# EAGLE design PS11_7000 (EAGLE 4.16)
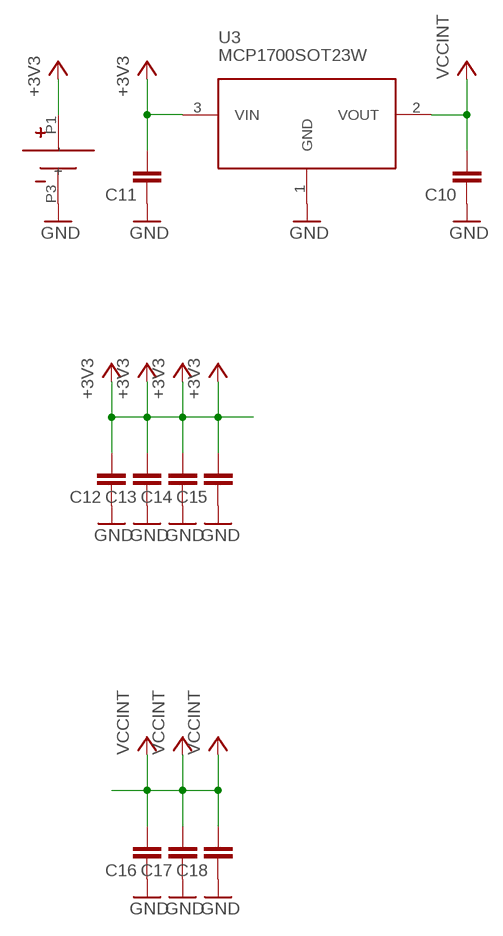
[diagram p0: schematic, sheet 1, part 1 of 2]
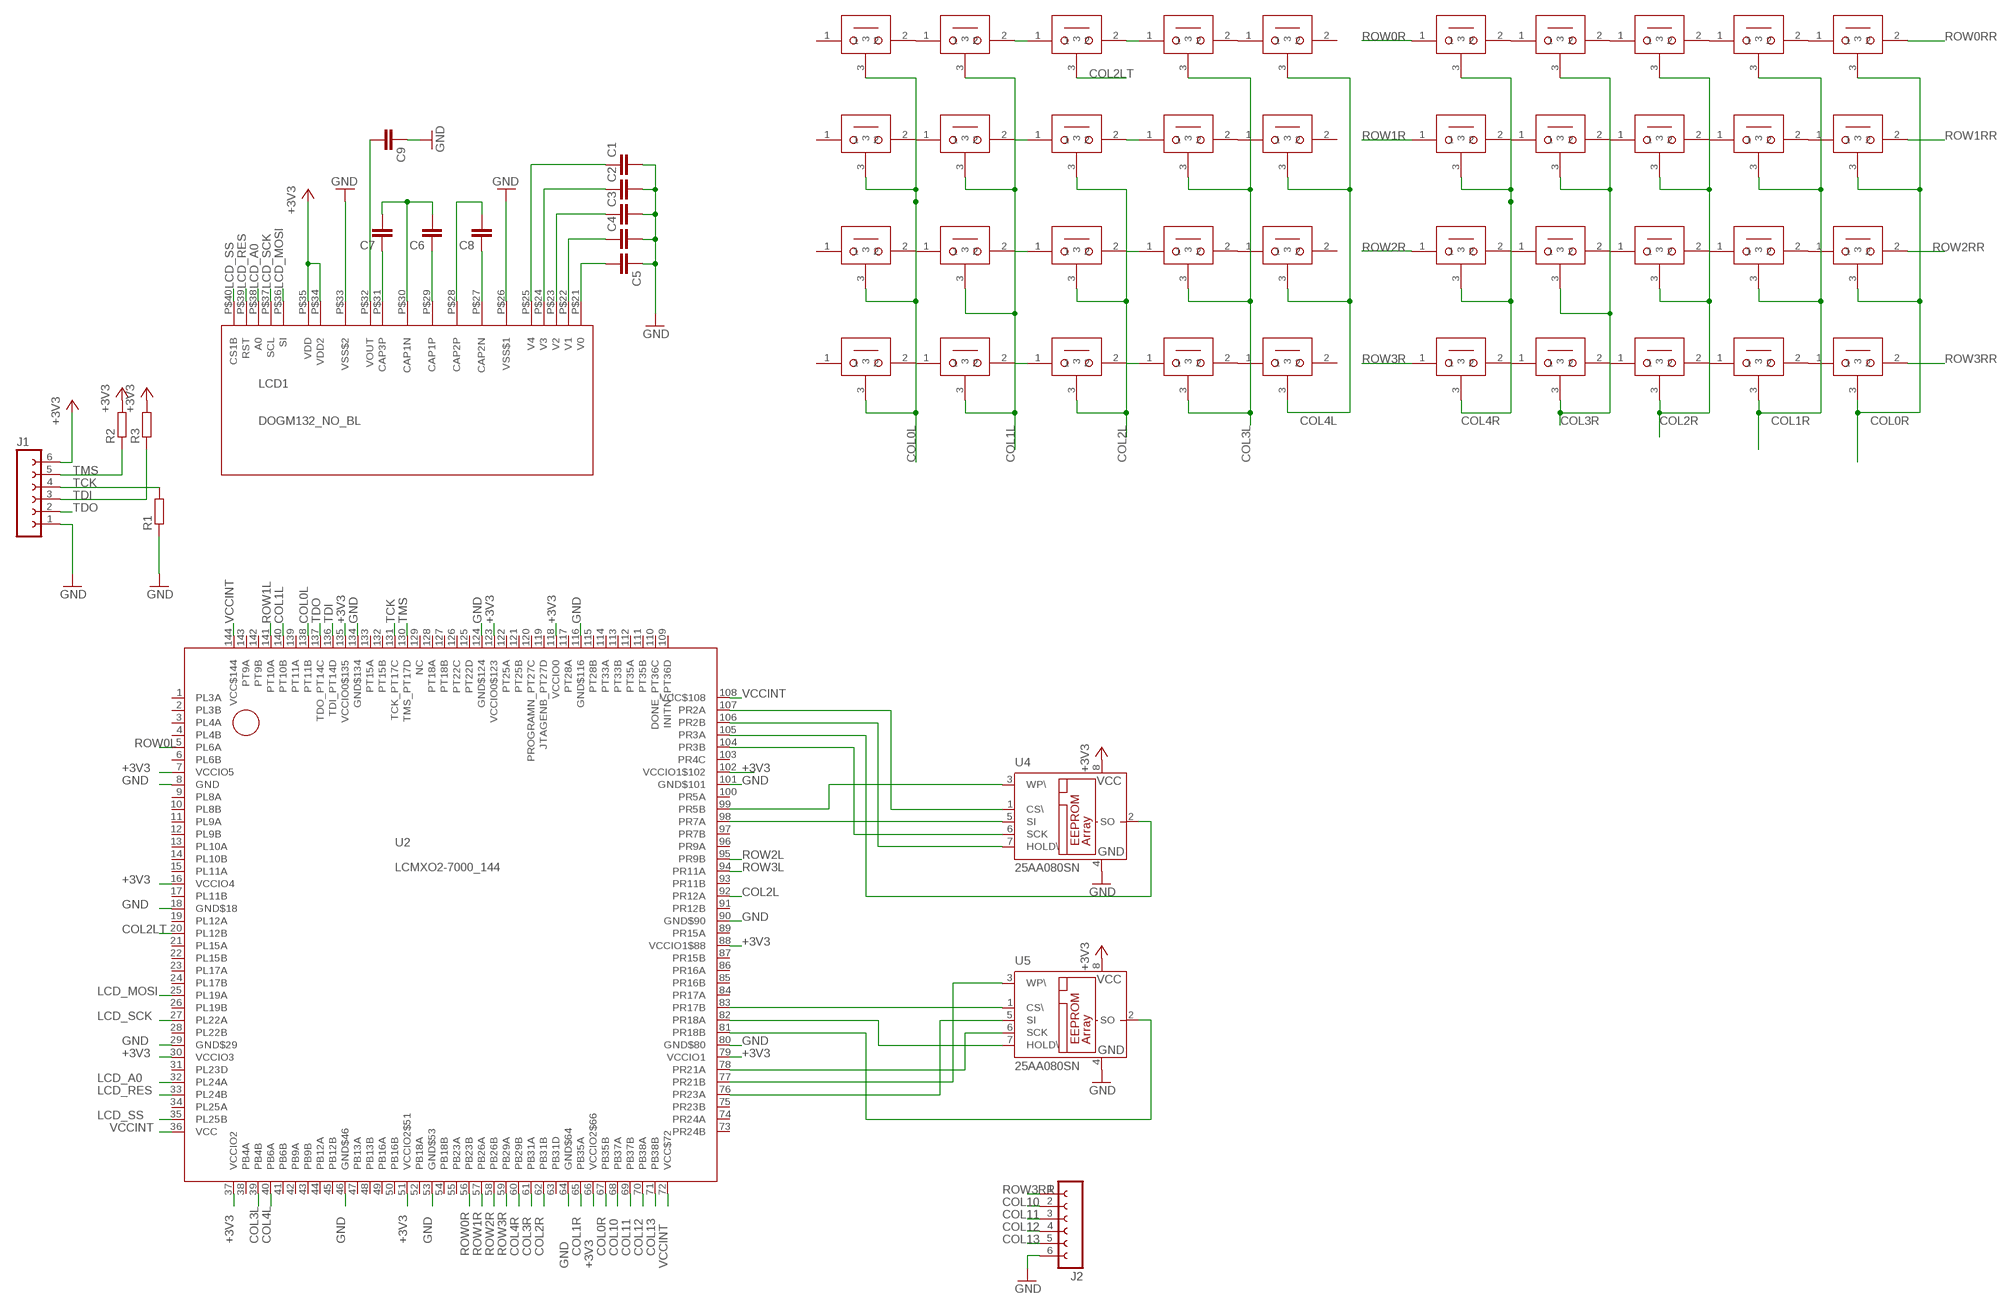
[diagram p1: schematic, sheet 1, part 2 of 2]

## Parts
C1  C-EUC1206K  [C1206K]
C2  C-EUC1206K  [C1206K]
C3  C-EUC1206K  [C1206K]
C4  C-EUC1206K  [C1206K]
C5  C-EUC1206K  [C1206K]
C6  C-EUC1206K  [C1206K]
C7  C-EUC1206K  [C1206K]
C8  C-EUC1206K  [C1206K]
C9  C-EUC1206K  [C1206K]
C10  C-EUC1206K  [C1206K]
C11  C-EUC1206K  [C1206K]
C12  C-EUC1206K  [C1206K]
C13  C-EUC1206K  [C1206K]
C14  C-EUC1206K  [C1206K]
C15  C-EUC1206K  [C1206K]
C16  C-EUC1206K  [C1206K]
C17  C-EUC1206K  [C1206K]
C18  C-EUC1206K  [C1206K]
J1  FE06-1S  [FE06-1S]
J2  FE06-1S  [FE06-1S]
LCD1  DOGM132_NO_BL  [DOGM132_NO_BL]
R1  R-EU_R1206W  [R1206W]
R2  R-EU_R1206W  [R1206W]
R3  R-EU_R1206W  [R1206W]
S1  DOME_9MM  [DOME_9MM]
S2  DOME_9MM  [DOME_9MM]
S3  DOME_9MM  [DOME_9MM]
S4  DOME_9MM  [DOME_9MM]
S5  DOME_9MM  [DOME_9MM]
S6  DOME_9MM  [DOME_9MM]
S7  DOME_9MM  [DOME_9MM]
S8  DOME_9MM  [DOME_9MM]
S9  DOME_9MM  [DOME_9MM]
S10  DOME_9MM  [DOME_9MM]
S11  DOME_9MM  [DOME_9MM]
S12  DOME_9MM  [DOME_9MM]
S13  DOME_9MM  [DOME_9MM]
S14  DOME_9MM  [DOME_9MM]
S15  DOME_9MM  [DOME_9MM]
S16  DOME_9MM  [DOME_9MM]
S17  DOME_9MM  [DOME_9MM]
S18  DOME_9MM  [DOME_9MM]
S19  DOME_9MM  [DOME_9MM]
S20  DOME_9MM  [DOME_9MM]
S21  DOME_9MM  [DOME_9MM]
S22  DOME_9MM  [DOME_9MM]
S23  DOME_9MM  [DOME_9MM]
S24  DOME_9MM  [DOME_9MM]
S25  DOME_9MM  [DOME_9MM]
S26  DOME_9MM  [DOME_9MM]
S27  DOME_9MM  [DOME_9MM]
S28  DOME_9MM  [DOME_9MM]
S29  DOME_9MM  [DOME_9MM]
S30  DOME_9MM  [DOME_9MM]
S31  DOME_9MM  [DOME_9MM]
S32  DOME_9MM  [DOME_9MM]
S33  DOME_9MM  [DOME_9MM]
S34  DOME_9MM  [DOME_9MM]
S35  DOME_9MM  [DOME_9MM]
S36  DOME_9MM  [DOME_9MM]
S37  DOME_9MM  [DOME_9MM]
S38  DOME_9MM  [DOME_9MM]
S39  DOME_9MM  [DOME_9MM]
S40  DOME_9MM  [DOME_9MM]
U2  LCMXO2-7000_144  [TQFP144]
U3  MCP1700SOT23W  [SOT23W_INFINEON]
U4  25AA080SN  [SO-08]
U5  25AA080SN  [SO-08]
U$1  LIBATT  [LIBATT_SMD]

## Nets
+3V3: C11.2 C12.2 C13.2 C14.2 C15.2 J1.6 LCD1.P$34(VDD2) LCD1.P$35(VDD) R2.2 R3.2 U2.7(VCCIO5) U2.16(VCCIO4) U2.30(VCCIO3) U2.37(VCCIO2) U2.51(VCCIO2$51) U2.66(VCCIO2$66) U2.79(VCCIO1) U2.88(VCCIO1$88) U2.102(VCCIO1$102) U2.118(VCCIO0) U2.123(VCCIO0$123) U2.135(VCCIO0$135) U3.3(VIN) U4.8(VCC) U5.8(VCC) U$1.P1(+)
COL0L: S1.3 S6.3 S11.3 S16.3 U2.138(PT11B)
COL0R: S25.3 S30.3 S35.3 S40.3 U2.67(PB35B)
COL1L: S2.3 S7.3 S12.3 S17.3 U2.140(PT10B)
COL1R: S24.3 S29.3 S34.3 S39.3 U2.65(PB35A)
COL2L: S8.3 S13.3 S18.3 U2.92(PR12A)
COL2LT: S3.3 U2.20(PL12B)
COL2R: S23.3 S28.3 S33.3 S38.3 U2.62(PB31B)
COL3L: S4.3 S9.3 S14.3 S19.3 U2.39(PB4B)
COL3R: S22.3 S27.3 S32.3 S37.3 U2.61(PB31A)
COL4L: S5.3 S10.3 S15.3 S20.3 U2.40(PB6A)
COL4R: S21.3 S26.3 S31.3 S36.3 U2.60(PB29B)
COL10: J2.2 U2.68(PB37A)
COL11: J2.3 U2.69(PB37B)
COL12: J2.4 U2.70(PB38A)
COL13: J2.5 U2.71(PB38B)
GND: C1.2 C2.2 C3.2 C4.2 C5.1 C9.1 C10.1 C11.1 C12.1 C13.1 C14.1 C15.1 C16.1 C17.1 C18.1 J1.1 J2.6 LCD1.P$26(VSS$1) LCD1.P$33(VSS$2) R1.1 U2.8(GND) U2.18(GND$18) U2.29(GND$29) U2.46(GND$46) U2.53(GND$53) U2.64(GND$64) U2.80(GND$80) U2.90(GND$90) U2.101(GND$101) U2.116(GND$116) U2.124(GND$124) U2.134(GND$134) U3.1(GND) U4.4(GND) U5.4(GND) U$1.P3(-)
LCD_A0: LCD1.P$38(A0) U2.32(PL24A)
LCD_MOSI: LCD1.P$36(SI) U2.25(PL19A)
LCD_RES: LCD1.P$39(RST) U2.33(PL24B)
LCD_SCK: LCD1.P$37(SCL) U2.27(PL22A)
LCD_SS: LCD1.P$40(CS1B) U2.35(PL25B)
N$1: C4.1 LCD1.P$22(V1)
N$2: S1.2 S2.1
N$4: C3.1 LCD1.P$23(V2)
N$5: C2.1 LCD1.P$24(V3)
N$6: C1.1 LCD1.P$25(V4)
N$8: S4.2 S5.1
N$9: S6.2 S7.1
N$12: C5.2 LCD1.P$21(V0)
N$13: U2.107(PR2A) U4.1(CS\)
N$14: S9.2 S10.1
N$15: S11.2 S12.1
N$18: S14.2 S15.1
N$19: S16.2 S17.1
N$22: S19.2 S20.1
N$23: S21.2 S22.1
N$24: S22.2 S23.1
N$25: S23.2 S24.1
N$26: S24.2 S25.1
N$27: S26.2 S27.1
N$28: S27.2 S28.1
N$29: S28.2 S29.1
N$30: S29.2 S30.1
N$31: C6.1 LCD1.P$29(CAP1P)
N$32: S31.2 S32.1
N$33: S32.2 S33.1
N$34: S33.2 S34.1
N$35: S34.2 S35.1
N$36: U2.106(PR2B) U4.7(HOLD\)
N$37: U2.105(PR3A) U4.2(SO)
N$38: U2.104(PR3B) U4.6(SCK)
N$39: S36.2 S37.1
N$40: U2.99(PR5B) U4.3(WP\)
N$41: S37.2 S38.1
N$42: S38.2 S39.1
N$43: S39.2 S40.1
N$44: U2.98(PR7A) U4.5(SI)
N$45: C6.2 C7.2 LCD1.P$30(CAP1N)
N$46: C7.1 LCD1.P$31(CAP3P)
N$47: C9.2 LCD1.P$32(VOUT)
N$48: C8.1 LCD1.P$27(CAP2N)
N$49: C8.2 LCD1.P$28(CAP2P)
N$50: U2.83(PR17B) U5.1(CS\)
N$51: U2.82(PR18A) U5.7(HOLD\)
N$52: U2.81(PR18B) U5.2(SO)
N$53: U2.78(PR21A) U5.6(SCK)
N$54: U2.77(PR21B) U5.3(WP\)
N$55: U2.76(PR23A) U5.5(SI)
N$400: S13.2 S14.1
N$401: S18.2 S19.1
N$456: S3.2 S4.1
N$457: S8.2 S9.1
ROW0L: S2.2 S3.1 U2.5(PL6A)
ROW0R: S21.1 U2.56(PB23B)
ROW0RR: S25.2
ROW1L: S7.2 S8.1 U2.141(PT10A)
ROW1R: S26.1 U2.57(PB26A)
ROW1RR: S30.2
ROW2L: S12.2 S13.1 U2.95(PR9B)
ROW2R: S31.1 U2.58(PB26B)
ROW2RR: S35.2
ROW3L: S17.2 S18.1 U2.94(PR11A)
ROW3R: S36.1 U2.59(PB29A)
ROW3RR: J2.1 S40.2
TCK: J1.4 R1.2 U2.131(TCK_PT17C)
TDI: J1.3 R3.1 U2.136(TDI_PT14D)
TDO: J1.2 U2.137(TDO_PT14C)
TMS: J1.5 R2.1 U2.130(TMS_PT17D)
VCCINT: C10.2 C16.2 C17.2 C18.2 U2.36(VCC) U2.72(VCC$72) U2.108(VCC$108) U2.144(VCC$144) U3.2(VOUT)
Unconnected: S1.1 S5.2 S6.1 S10.2 S11.1 S15.2 S16.1 S20.2 U2.1(PL3A) U2.2(PL3B) U2.3(PL4A) U2.4(PL4B) U2.6(PL6B) U2.9(PL8A) U2.10(PL8B) U2.11(PL9A) U2.12(PL9B) U2.13(PL10A) U2.14(PL10B) U2.15(PL11A) U2.17(PL11B) U2.19(PL12A) U2.21(PL15A) U2.22(PL15B) U2.23(PL17A) U2.24(PL17B) U2.26(PL19B) U2.28(PL22B) U2.31(PL23D) U2.34(PL25A) U2.38(PB4A) U2.41(PB6B) U2.42(PB9A) U2.43(PB9B) U2.44(PB12A) U2.45(PB12B) U2.47(PB13A) U2.48(PB13B) U2.49(PB16A) U2.50(PB16B) U2.52(PB18A) U2.54(PB18B) U2.55(PB23A) U2.63(PB31D) U2.73(PR24B) U2.74(PR24A) U2.75(PR23B) U2.84(PR17A) U2.85(PR16B) U2.86(PR16A) U2.87(PR15B) U2.89(PR15A) U2.91(PR12B) U2.93(PR11B) U2.96(PR9A) U2.97(PR7B) U2.100(PR5A) U2.103(PR4C) U2.109(INITN_PT36D) U2.110(DONE_PT36C) U2.111(PT35B) U2.112(PT35A) U2.113(PT33B) U2.114(PT33A) U2.115(PT28B) U2.117(PT28A) U2.119(JTAGENB_PT27D) U2.120(PROGRAMN_PT27C) U2.121(PT25B) U2.122(PT25A) U2.125(PT22D) U2.126(PT22C) U2.127(PT18B) U2.128(PT18A) U2.129(NC) U2.132(PT15B) U2.133(PT15A) U2.139(PT11A) U2.142(PT9B) U2.143(PT9A)

## Library data of the parts
C1-C18 = rcl:C-EU: CAPACITOR, European symbol
J1 J2 = con-lsta:FE06-1: FEMALE HEADER
LCD1 = DOGM:DOGM132_NO_BL
R1-R3 = rcl:R-EU_: RESISTOR, European symbol
S1-S40 = Metaldomes:DOME_9MM
U2 = MachXO2:LCMXO2-7000_144: MachXO2-7000 TQFP144
U3 = MCP17xx:MCP1700
U4 U5 = microchip:25*: Serial EEPROM 4 K, SPI bus
U$1 = MCP17xx:LIBATT

## Board
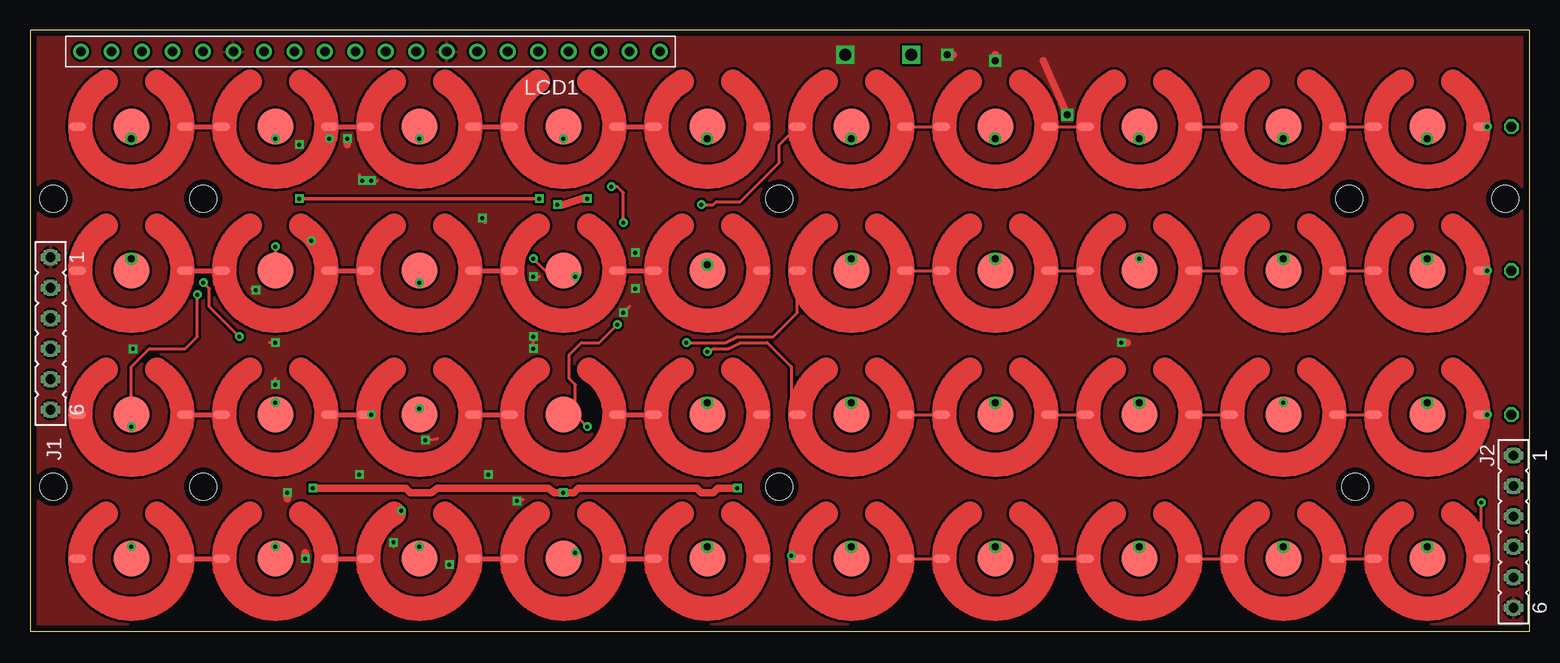
[diagram p2: board, top side]
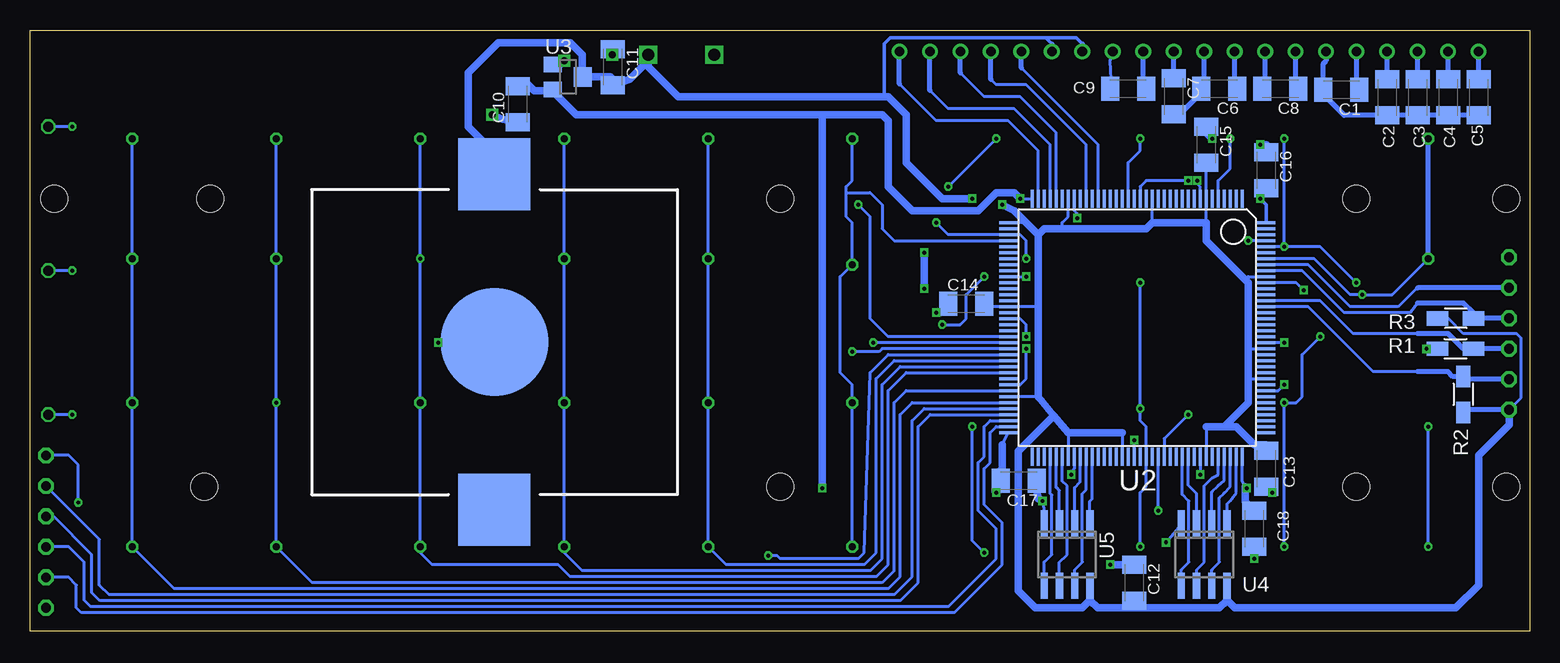
[diagram p3: board, bottom side, seen from below]

Size 124.96 x 50.09 mm. Coordinates in mm from the lower left corner, seen from the top.
Outline: 0,0 124.96,0 124.96,50.09 0,50.09 0,0
Copper layers (1+16): Top 0.035mm / dielectric 1.5mm / Bottom 0.035mm
Design rules "default": minimum track width 0.2mm, minimum drill 0.3mm, track to track 0.2mm, track to pad 0.2mm, pad to pad 0.2mm, via to via 0.2mm, smd to smd 0mil, copper to edge 0.5mm, drill to drill 8mil, minimum pad ring 10mil, minimum via ring 8mil, stop-mask expansion 4mil, vias tented up to drill 0mil, thermal gap 10mil
Holes 2.2 mm at 14.44,36.03 14.44,12.03 1.94,36.03 1.94,12.03 62.44,36.03 62.44,12.03 110.44,12.03 109.94,36.03 122.94,36.03

### Footprints (pad centres in the part's own frame; a part is rotated, then mirrored left to right if it is on the bottom)
C1206K = smd 1.5 x 2: 1 -1.5,0; 2 1.5,0
FE06-1S = drill 0.813 octagon: 1 -6.35,0; 2 -3.81,0; 3 -1.27,0; 4 1.27,0; 5 3.81,0; 6 6.35,0
DOGM132_NO_BL = drill 0.8 round: P$21 24.13,0.635; P$22 21.59,0.635; P$23 19.05,0.635; P$24 16.51,0.635; P$25 13.97,0.635; P$26 11.43,0.635; P$27 8.89,0.635; P$28 6.35,0.635; P$29 3.81,0.635; P$30 1.27,0.635; P$31 -1.27,0.635; P$32 -3.81,0.635; P$33 -6.35,0.635; P$34 -8.89,0.635; P$35 -11.43,0.635; P$36 -13.97,0.635; P$37 -16.51,0.635; P$38 -19.05,0.635; P$39 -21.59,0.635; P$40 -24.13,0.635
R1206W = smd 1.8 x 1.2: 1 -1.499,0; 2 1.499,0
DOME_9MM = smd 1.422 x 0.711: 1 -4.5,0; 2 4.5,0 | smd 3 x 3: 3 0,0
TQFP144 = smd 0.27 x 1.5: 1 -8.75,-10.75; 2 -8.25,-10.75; 3 -7.75,-10.75; 4 -7.25,-10.75; 5 -6.75,-10.75; 6 -6.25,-10.75; 7 -5.75,-10.75; 8 -5.25,-10.75; 9 -4.75,-10.75; 10 -4.25,-10.75; 11 -3.75,-10.75; 12 -3.25,-10.75; 13 -2.75,-10.75; 14 -2.25,-10.75; 15 -1.75,-10.75; 16 -1.25,-10.75; 17 -0.75,-10.75; 18 -0.25,-10.75; 19 0.25,-10.75; 20 0.75,-10.75; 21 1.25,-10.75; 22 1.75,-10.75; 23 2.25,-10.75; 24 2.75,-10.75; 25 3.25,-10.75; 26 3.75,-10.75; 27 4.25,-10.75; 28 4.75,-10.75; 29 5.25,-10.75; 30 5.75,-10.75; 31 6.25,-10.75; 32 6.75,-10.75; 33 7.25,-10.75; 34 7.75,-10.75; 35 8.25,-10.75; 36 8.75,-10.75; 73 8.75,10.75; 74 8.25,10.75; 75 7.75,10.75; 76 7.25,10.75; 77 6.75,10.75; 78 6.25,10.75; 79 5.75,10.75; 80 5.25,10.75; 81 4.75,10.75; 82 4.25,10.75; 83 3.75,10.75; 84 3.25,10.75; 85 2.75,10.75; 86 2.25,10.75; 87 1.75,10.75; 88 1.25,10.75; 89 0.75,10.75; 90 0.25,10.75; 91 -0.25,10.75; 92 -0.75,10.75; 93 -1.25,10.75; 94 -1.75,10.75; 95 -2.25,10.75; 96 -2.75,10.75; 97 -3.25,10.75; 98 -3.75,10.75; 99 -4.25,10.75; 100 -4.75,10.75; 101 -5.25,10.75; 102 -5.75,10.75; 103 -6.25,10.75; 104 -6.75,10.75; 105 -7.25,10.75; 106 -7.75,10.75; 107 -8.25,10.75; 108 -8.75,10.75 | smd 1.5 x 0.27: 37 10.75,-8.75; 38 10.75,-8.25; 39 10.75,-7.75; 40 10.75,-7.25; 41 10.75,-6.75; 42 10.75,-6.25; 43 10.75,-5.75; 44 10.75,-5.25; 45 10.75,-4.75; 46 10.75,-4.25; 47 10.75,-3.75; 48 10.75,-3.25; 49 10.75,-2.75; 50 10.75,-2.25; 51 10.75,-1.75; 52 10.75,-1.25; 53 10.75,-0.75; 54 10.75,-0.25; 55 10.75,0.25; 56 10.75,0.75; 57 10.75,1.25; 58 10.75,1.75; 59 10.75,2.25; 60 10.75,2.75; 61 10.75,3.25; 62 10.75,3.75; 63 10.75,4.25; 64 10.75,4.75; 65 10.75,5.25; 66 10.75,5.75; 67 10.75,6.25; 68 10.75,6.75; 69 10.75,7.25; 70 10.75,7.75; 71 10.75,8.25; 72 10.75,8.75; 109 -10.75,8.75; 110 -10.75,8.25; 111 -10.75,7.75; 112 -10.75,7.25; 113 -10.75,6.75; 114 -10.75,6.25; 115 -10.75,5.75; 116 -10.75,5.25; 117 -10.75,4.75; 118 -10.75,4.25; 119 -10.75,3.75; 120 -10.75,3.25; 121 -10.75,2.75; 122 -10.75,2.25; 123 -10.75,1.75; 124 -10.75,1.25; 125 -10.75,0.75; 126 -10.75,0.25; 127 -10.75,-0.25; 128 -10.75,-0.75; 129 -10.75,-1.25; 130 -10.75,-1.75; 131 -10.75,-2.25; 132 -10.75,-2.75; 133 -10.75,-3.25; 134 -10.75,-3.75; 135 -10.75,-4.25; 136 -10.75,-4.75; 137 -10.75,-5.25; 138 -10.75,-5.75; 139 -10.75,-6.25; 140 -10.75,-6.75; 141 -10.75,-7.25; 142 -10.75,-7.75; 143 -10.75,-8.25; 144 -10.75,-8.75
SOT23W_INFINEON = smd 1.5 x 1.3: 1 -1.25,1.05; 2 -1.25,-1.05 | smd 1.5 x 1.6: 3 1.25,0
SO-08 = smd 0.6 x 2.2: 1 -1.905,-2.6; 2 -0.635,-2.6; 3 0.635,-2.6; 4 1.905,-2.6; 5 1.905,2.6; 6 0.635,2.6; 7 -0.635,2.6; 8 -1.905,2.6
LIBATT_SMD = smd 6 x 6: P1 0,13.97; P2 0,-13.97 | smd 9 x 9: P3 0,0

### Placement (x,y rotation side)
C1  15.68,45.12 180 bottom
C2  11.87,44.48 270 bottom
C3  9.33,44.48 270 bottom
C4  6.79,44.48 270 bottom
C5  4.25,44.48 90 bottom
C6  25.84,45.2 180 bottom
C7  29.65,44.56 270 bottom
C8  20.76,45.2 180 bottom
C9  33.46,45.2 0 bottom
C10  84.33,43.91 90 bottom
C11  76.38,47 270 bottom
C12  32.94,4.03 270 bottom
C13  21.94,13.53 90 bottom
C14  46.94,27.28 0 bottom
C15  26.94,40.53 270 bottom
C16  21.94,38.41 270 bottom
C17  42.56,12.53 180 bottom
C18  22.94,8.53 90 bottom
J1  1.71,24.8 270 top
J2  123.63,8.29 270 top
LCD1  28.38,48.93 180 top
R1  6.16,23.53 0 bottom
R2  5.52,19.71 270 bottom
R3  6.16,26.07 180 bottom
S1  8.44,42.03 0 top
S2  20.44,42.03 0 top
S3  32.44,42.03 0 top
S4  44.44,42.03 0 top
S5  56.44,42.03 0 top
S6  8.44,30.03 0 top
S7  20.44,30.03 0 top
S8  32.44,30.03 0 top
S9  44.44,30.03 0 top
S10  56.44,30.03 0 top
S11  8.44,18.03 0 top
S12  20.44,18.03 0 top
S13  32.44,18.03 0 top
S14  44.44,18.03 0 top
S15  56.44,18.03 0 top
S16  8.44,6.03 0 top
S17  20.44,6.03 0 top
S18  32.44,6.03 0 top
S19  44.44,6.03 0 top
S20  56.44,6.03 0 top
S21  68.44,42.03 0 top
S22  80.44,42.03 0 top
S23  92.44,42.03 0 top
S24  104.44,42.03 0 top
S25  116.44,42.03 0 top
S26  68.44,30.03 0 top
S27  80.44,30.03 0 top
S28  92.44,30.03 0 top
S29  104.44,30.03 0 top
S30  116.44,30.03 0 top
S31  68.44,18.03 0 top
S32  80.44,18.03 0 top
S33  92.44,18.03 0 top
S34  104.44,18.03 0 top
S35  116.44,18.03 0 top
S36  68.44,6.03 0 top
S37  80.44,6.03 0 top
S38  92.44,6.03 0 top
S39  104.44,6.03 0 top
S40  116.44,6.03 0 top
U2  32.69,25.28 180 bottom
U3  80.13,46.18 0 bottom
U4  27.11,6.38 180 bottom
U5  38.54,6.38 180 bottom
U$1  86.26,24.08 0 bottom

### Tracks (layer width: path | path; a pad name or v marks a point on that pad's centre or on a via)
+3V3  (via drill 0.3, 1)
  Top 0.61: v46.44,36.03 45.94,36.03 44.44,35.53 v43.94,35.53
  Bottom 0.254: 23.44,21.03 U2.118 | 26.94,34.03 U2.7 C15.2 | 31.44,34.03 U2.16 | U2.30 38.44,34.53 38.94,34.03 38.94,33.53 | 41.94,34.03 U2.37 | 38.44,16.53 U2.79 | 33.94,16.53 U2.88 | 40.94,19.53 U2.66 | 26.94,17.03 U2.102 | 23.44,23.53 U2.123 | 40.94,27.03 U2.51 44.94,27.03 45.19,27.28 C14.2 | R3.2 6.79,26.07 5.52,24.8 1.07,24.8 0.69,24.41 0.69,19.46 J1.6 | 23.69,29.28 23.44,29.53 U2.135
  Bottom 0.305: 40.32,49.44 39.81,48.93 | 37.27,48.93 37.78,49.44 40.32,49.44 | 40.32,49.44 53.27,49.44 53.78,48.93 53.78,44.53 53.78,44.48
  Bottom 0.406: R2.2 5.52,18.45 J1.6 | 37.27,48.93 LCD1.P$34 | 39.81,48.93 LCD1.P$35
  Bottom 0.61: 40.94,33.03 41.94,34.03 42.94,35.03 v43.94,35.53 | 33.94,16.53 38.44,16.53 39.63,17.96 | 39.63,17.96 40.94,19.53 40.94,27.03 40.94,33.03 | 25.44,17.03 23.44,19.03 23.44,21.03 23.44,23.53 23.44,29.03 23.69,29.28 26.94,32.53 26.94,34.03 31.44,34.03 31.94,33.53 38.94,33.53 40.44,33.53 40.94,33.03 | 25.44,17.03 26.94,17.03 | v46.44,36.03 48.94,36.03 51.94,39.03 51.94,43.03 53.44,44.53 53.78,44.53 70.94,44.53 73.44,47.03 v73.44,48.03 73.44,47.53 74.97,46 C11.2 76.41,46 76.59,46.18 U3.3 78.88,46.09 78.94,46.03 78.94,48.03 79.94,49.03 85.94,49.03 88.44,46.53 88.44,42.03 86.26,39.85 U$1.P1 | J1.6 1.71,17.18 4.25,14.63 4.25,3.84 6.16,1.94 24.57,1.94 25.21,2.57 | 25.21,2.57 U4.8 | 25.21,2.57 25.84,1.94 32.94,1.94 | 32.94,1.94 36,1.94 36.63,2.57 | 36.63,3.84 U5.8 36.63,2.57 | 36.63,2.57 37.27,1.94 41.17,1.94 42.62,3.38 42.62,15 39.66,17.96 39.63,17.96 | 25.44,17.03 24.44,17.03 22.94,15.53 21.94,15.53 C13.2 | 32.94,1.94 C12.2
COL0L  (via drill 0.3, 0.6)
  Top 0.254: v13.94,28.03 13.94,24.53 12.94,23.53 9.94,23.53 8.44,22.03 S11.3 v8.44,17.03 | v8.44,31.03 S6.3 | S16.3 v8.44,7.03
  Top 0.406: v8.44,41.03 S1.3
  Bottom 0.254: v8.44,31.03 11.44,28.03 v13.94,28.03 14.94,28.03 17.94,31.03 U2.138 | v8.44,7.03 v8.44,17.03
  Bottom 0.406: v8.44,31.03 v8.44,41.03
COL0R  (via drill 0.6)
  Top 0.254: v116.44,41.03 S25.3 | v116.44,7.03 S40.3 | v116.44,19.03 S35.3 | v116.44,31.03 S30.3
  Bottom 0.254: v116.44,41.03 v116.44,31.03 v116.44,19.03 v116.44,7.03 112.94,3.53 53.44,3.53 52.44,4.53 52.44,18.03 51.44,19.03 U2.67
COL1L  (via drill 0.3)
  Top 0.254: S17.3 v20.44,7.03 | v20.44,19.03 S12.3 | v17.44,24.53 14.94,27.03 14.94,28.53 v14.44,29.03 | v20.44,32.03 S7.3 | v20.44,41.03 S2.3
  Bottom 0.254: v20.44,7.03 S12.3 v20.44,19.03 19.44,19.03 18.94,19.53 18.94,23.03 v17.44,24.53 | v14.44,29.03 17.44,32.03 v20.44,32.03 | v20.44,32.03 v20.44,41.03 | v20.44,32.03 U2.140
COL1R  (via drill 0.3, 0.6)
  Top 0.254: v104.44,41.03 S24.3 | v104.44,31.03 S29.3 | v104.44,7.03 S39.3 | v104.44,19.03 S34.3
  Bottom 0.254: v104.44,41.03 v104.44,31.03 v104.44,19.03 v104.44,7.03 101.44,4.03 53.94,4.03 52.94,5.03 52.94,19.03 51.94,20.03 U2.65
COL2L  (via drill 0.3)
  Top 0.254: v32.44,29.03 S8.3 | v32.44,18.53 S13.3 | S18.3 v32.44,7.03
  Bottom 0.254: v32.44,29.03 v32.44,18.53 32.44,17.53 31.94,17.03 U2.92 31.94,12.03 32.44,11.53 v32.44,7.03
COL2LT  (via drill 0.3)
  Top 0.254: v32.44,41.03 S3.3
  Bottom 0.254: U2.20 33.44,39.03 32.44,40.03 v32.44,41.03
COL2R  (via drill 0.3, 0.6)
  Top 0.254: v92.44,7.03 S38.3 | v92.44,41.03 S23.3 | v92.44,31.03 S28.3 | v92.44,19.03 S33.3
  Bottom 0.254: v92.44,41.03 v92.44,31.03 v92.44,19.03 v92.44,7.03 92.44,6.53 91.44,5.53 80.94,5.53 79.94,4.53 54.44,4.53 53.44,5.53 53.44,20.03 51.94,21.53 U2.62
COL3L  (via drill 0.3)
  Top 0.254: v44.44,41.03 S4.3 | S19.3 44.44,6.53 v45.44,6.53 | 45.44,18.03 S14.3 | v45.44,29.53 44.94,30.03 S9.3 42.94,30.03 v41.94,31.03 | v48.94,25.53 47.44,24.03 45.94,24.03 44.94,23.03 44.94,21.03 45.44,20.53 45.44,18.03 | v46.44,17.03 45.44,18.03 | v49.44,34.03 49.44,36.53 48.94,37.03 v48.44,37.03
  Bottom 0.254: v48.44,37.03 v44.44,41.03 | v45.44,6.53 46.44,7.53 v46.44,17.03 | v45.44,29.53 46.94,28.03 46.94,26.03 47.44,25.53 v48.94,25.53 | v49.44,34.03 48.44,33.03 U2.39 42.44,33.03 41.94,32.53 v41.94,31.03
COL3R  (via drill 0.6)
  Top 0.254: v80.44,7.03 S37.3 | v80.44,41.03 S22.3 | v80.44,19.03 S32.3 | v80.44,31.03 S27.3
  Bottom 0.254: v80.44,41.03 v80.44,31.03 v80.44,19.03 v80.44,7.03 80.44,6.53 78.94,5.03 54.94,5.03 53.94,6.03 53.94,20.53 52.44,22.03 U2.61
COL4L  (via drill 0.6)
  Top 0.254: v56.44,41.03 S5.3 | 56.44,29.53 S10.3 v56.44,30.53 | S20.3 v56.44,7.03 | v56.44,19.03 S15.3
  Bottom 0.254: 56.94,36.53 56.94,34.53 56.44,34.03 v56.44,30.53 57.44,29.53 57.44,21.53 56.44,20.53 v56.44,19.03 v56.44,7.03 | 56.94,36.53 56.94,37.03 56.44,37.53 v56.44,41.03 | U2.40 52.94,32.53 53.94,33.53 53.94,35.53 54.94,36.53 56.94,36.53
COL4R  (via drill 0.6)
  Top 0.254: v68.44,7.03 S36.3 | v68.44,19.03 S31.3 | v68.44,31.03 S26.3 | v68.44,41.03 S21.3
  Bottom 0.254: v68.44,41.03 v68.44,31.03 v68.44,19.03 v68.44,7.03 66.94,5.53 55.44,5.53 54.44,6.53 54.44,21.03 52.94,22.53 U2.60
COL10
  Bottom 0.254: U2.68 50.44,18.53 51.44,17.53 51.44,4.53 52.94,3.03 118.38,3.03 119.19,3.84 119.19,7.65 J2.2
COL11
  Bottom 0.254: U2.69 49.94,18.03 50.94,17.03 50.94,4.03 52.44,2.53 119.14,2.53 119.82,3.2 119.82,6.38 123,9.55 J2.3
COL12
  Bottom 0.254: U2.70 44.94,17.53 45.44,17.03 45.44,14.53 45.94,14.03 45.94,10.03 44.44,8.53 44.44,6.03 48.44,2.03 119.91,2.03 120.45,2.57 120.45,5.75 121.72,7.02 J2.4
COL13
  Bottom 0.254: U2.71 44.44,17.03 44.94,16.53 44.94,14.03 45.44,13.53 45.44,10.53 43.94,9.03 43.94,5.53 47.94,1.53 120.69,1.53 121.09,1.94 121.09,3.84 121.72,4.48 J2.5
GND  (via drill 0.3, 0.6, 1)
  Top 0.254: v38.19,13.03 37.94,13.03 | v32.94,15.9 33.94,16.03 | v20.44,20.53 20.44,21.03 | v20.44,24.03 19.94,24.03 | v37.69,34.41 37.94,34.03 | v28.44,37.53 28.94,37.53 | v27.69,37.53 27.44,38.03 | v40.58,10.82 41.08,10.96 | v30.29,7.4 30.29,7.02 | v8.57,23.53 8.33,23.53 | v49.44,26.53 49.94,27.03 | v41.94,29.53 42.44,29.53 | v41.94,23.53 v41.94,24.53 | v18.82,28.41 18.44,28.53
  Top 0.61: v76.44,48.03 76.94,48.03 | v80.44,47.53 80.44,48.03 | v86.44,43.03 84.44,47.53 | v21.44,11.53 21.44,11.03 | v22.94,6.03 22.94,6.53 | 26.44,40.53 v26.44,41.03 | v90.94,24.03 91.44,24.03
  Bottom 0.254: U2.64 42.44,20.53 41.94,21.03 v41.94,23.53 | v38.19,13.03 38.19,13.28 37.94,13.53 U2.80 | U2.90 v32.94,15.9 | U2.101 v27.44,13.03 | U2.116 20.94,20.03 v20.44,20.53 | v20.44,24.03 U2.124 | v37.69,34.41 37.69,34.78 37.94,35.03 U2.29 | v28.44,37.53 31.94,37.53 32.44,37.03 U2.18 | U2.8 27.44,37.03 27.69,37.28 v27.69,37.53 | U5.4 40.45,10.19 v40.58,10.82 | U4.4 29.02,8.92 v30.29,7.4 | R1.1 v8.57,23.53 | C14.1 v49.44,26.53 | U2.46 v41.94,29.53 | U2.53 42.44,26.03 41.94,25.53 v41.94,24.53 | U2.134 19.44,29.03 v18.82,28.41 | LCD1.P$33 34.94,47.53 34.81,45.2 | 16.94,47.53 LCD1.P$26
  Bottom 0.406: C5.1 C4.2 | C4.2 6.79,43.21 | C4.2 C3.2 | C3.2 9.33,43.21 | C3.2 C2.2 | C2.2 11.87,43.21 | C2.2 15.45,42.98 16.95,44.48 16.95,45.12 C1.2 17.18,47.29 16.94,47.53 16.95,47.54 LCD1.P$26 | 34.73,45.12 34.81,45.2 C9.1
  Bottom 0.61: C11.1 76.38,48.09 v76.44,48.03 | U3.1 80.74,47.23 v80.44,47.53 | C10.1 85.55,42.65 v86.44,43.03 | v40.58,10.82 40.58,10.89 40.94,11.03 41.06,11.65 C17.1 | C13.1 v21.44,11.53 | C18.1 v22.94,6.03 | C12.1 v34.94,5.53 | C16.1 21.94,40.53 v22.44,40.53 | C15.1 26.94,41.53 v26.44,41.03 | v50.44,28.53 v50.44,31.53 | U$1.P3 90.89,24.08 v90.94,24.03
  other vias: 67.94,48.03
  pour Top: 0.44,49.53 0.44,0.53 124.44,0.53 124.44,49.53
LCD_A0
  Bottom 0.254: 47.43,46.52 45.44,44.53 42.44,44.53 39.44,41.53 U2.32
  Bottom 0.406: 47.43,46.52 LCD1.P$38
LCD_MOSI
  Bottom 0.254: 42.35,46.94 35.94,40.53 U2.25
  Bottom 0.406: 42.35,46.94 LCD1.P$36
LCD_RES
  Bottom 0.254: 49.97,45.06 48.44,43.53 42.94,43.53 39.94,40.53 U2.33
  Bottom 0.406: 49.97,45.06 LCD1.P$39
LCD_SCK
  Bottom 0.254: 44.89,45.98 44.44,45.53 41.94,45.53 36.94,40.53 U2.27
  Bottom 0.406: 44.89,45.98 LCD1.P$37
LCD_SS
  Bottom 0.254: U2.35 40.94,40.03 43.44,42.53 49.44,42.53 52.51,45.6
  Bottom 0.406: 52.51,45.6 LCD1.P$40
N$1
  Bottom 0.406: 6.79,45.75 C4.1 LCD1.P$22
N$2
  Top 0.406: S1.2 S2.1
N$4
  Bottom 0.406: 9.33,45.75 C3.1 LCD1.P$23
N$5
  Bottom 0.406: 11.87,45.75 C2.1 LCD1.P$24
N$6
  Bottom 0.406: C1.1 14.41,45.12 LCD1.P$25
N$8
  Top 0.406: S4.2 S5.1
N$9
  Top 0.406: S6.2 S7.1
N$12
  Bottom 0.406: 4.25,45.75 C5.2 LCD1.P$21
N$13
  Bottom 0.254: 25.21,8.92 U4.1 25.21,10.59 24.94,10.86 24.44,11.53 U2.107
N$14
  Top 0.406: S9.2 S10.1
N$15
  Top 0.406: 16.44,18.03 S12.1 S11.2
N$18
  Top 0.406: 52.44,18.03 S15.1 S14.2
N$19
  Top 0.406: S16.2 S17.1
N$22
  Top 0.406: 52.44,6.03 S20.1 S19.2
N$23
  Top 0.254: S21.2 S22.1
N$24
  Top 0.254: S22.2 S23.1
N$25
  Top 0.254: S23.2 S24.1
N$26
  Top 0.254: S24.2 S25.1
N$27
  Top 0.254: S26.2 S27.1
N$28
  Top 0.254: S27.2 S28.1
N$29
  Top 0.254: S28.2 S29.1
N$30
  Top 0.254: S29.2 S30.1
N$31
  Bottom 0.406: 24.57,45.12 24.49,45.2 C6.1 24.57,45.2 24.57,45.12 | 24.57,45.12 LCD1.P$29
N$32
  Top 0.254: S31.2 S32.1
N$33
  Top 0.254: S32.2 S33.1
N$34
  Top 0.254: S33.2 S34.1
N$35
  Top 0.254: S34.2 S35.1
N$36
  Bottom 0.254: U4.7 26.48,5.11 25.84,5.75 25.84,11.09 25.44,11.49 24.94,12.03 U2.106
N$37
  Bottom 0.254: U4.2 26.48,11.59 25.94,12.13 25.44,12.53 U2.105
N$38
  Bottom 0.254: U4.6 27.75,5.11 27.11,5.75 27.11,12.09 26.44,12.76 25.94,13.03 U2.104
N$39
  Top 0.254: S36.2 S37.1
N$40
  Bottom 0.254: U2.99 28.44,12.15 27.75,11.46 U4.3 27.75,8.92
N$41
  Top 0.254: S37.2 S38.1
N$42
  Top 0.254: S38.2 S39.1
N$43
  Top 0.254: 112.44,6.03 S40.1 S39.2
N$44
  Bottom 0.254: U4.5 29.02,5.11 28.38,5.75 28.38,10.82 28.94,11.38 U2.98
N$45
  Bottom 0.406: 27.11,45.12 27.19,45.2 C6.2 27.11,45.2 27.11,45.12 | C7.2 29.17,43.06 27.11,45.12 | 27.11,45.12 LCD1.P$30
N$46
  Bottom 0.406: 29.65,45.75 C7.1 LCD1.P$31
N$47
  Bottom 0.406: 32.19,45.12 32.11,45.2 C9.2 32.19,45.2 32.19,45.12 | 32.19,45.12 LCD1.P$32
N$48
  Bottom 0.406: 19.49,45.12 19.41,45.2 C8.1 19.49,45.2 19.49,45.12 | 19.49,45.12 LCD1.P$27
N$49
  Bottom 0.406: 22.03,45.12 22.11,45.2 C8.2 22.03,45.2 22.03,45.12 | 22.03,45.12 LCD1.P$28
N$50
  Bottom 0.254: U2.83 36.44,11.02 36.63,10.82 U5.1 36.63,8.92
N$51
  Bottom 0.254: U2.82 36.94,11.79 37.27,11.46 37.27,5.75 37.91,5.11 U5.7
N$52
  Bottom 0.254: U2.81 37.44,12.42 37.91,11.96 U5.2 37.91,8.92
N$53
  Bottom 0.254: U2.78 38.94,12.49 38.54,12.09 38.54,6.38 39.17,5.75 U5.6
N$54
  Bottom 0.254: U5.3 39.17,11.71 39.44,11.97 U2.77
N$55
  Bottom 0.254: U2.76 39.94,11.46 39.81,11.32 39.81,6.38 40.45,5.75 U5.5
N$400
  Top 0.406: S13.2 S14.1
N$401
  Top 0.406: 40.44,6.03 S19.1 S18.2
N$456
  Top 0.406: S3.2 S4.1
N$457
  Top 0.406: 40.44,30.03 S9.1 S8.2
ROW0L  (via drill 0.3)
  Top 0.254: v24.94,41.03 S2.2
  Top 0.406: 28.44,42.03 S3.1 S2.2
  Bottom 0.254: U2.5 25.94,37.53 24.94,38.53 v24.94,41.03
ROW0R  (via drill 0.3)
  Top 0.254: v55.94,35.53 56.94,35.53 57.19,35.78 59.19,35.78 62.44,39.03 62.44,40.53 S21.1
  Bottom 0.254: v55.94,35.53 54.94,34.53 54.94,26.03 53.44,24.53 U2.56
ROW0RR  (via drill 0.3, 0.8)
  Top 0.254: S25.2 v121.44,42.03
  Bottom 0.254: v121.44,42.03 v123.44,42.03
ROW1L  (via drill 0.3)
  Top 0.254: S7.2 24.94,31.53 23.94,32.53 v23.44,32.53
  Top 0.406: S7.2 S8.1
  Bottom 0.254: U2.141 v23.44,32.53
ROW1R  (via drill 0.3)
  Top 0.254: v54.69,24.03 57.94,24.03 58.94,24.53 61.94,24.53 63.94,26.53 S26.1
  Bottom 0.254: U2.57 v54.69,24.03
ROW1RR  (via drill 0.3, 0.8)
  Top 0.254: S30.2 v121.44,30.03
  Bottom 0.254: v121.44,30.03 v123.44,30.03
ROW2L  (via drill 0.3)
  Top 0.406: v28.44,18.03 S13.1 S12.2
  Bottom 0.254: U2.95 30.44,16.03 v28.44,18.03
ROW2R  (via drill 0.3)
  Top 0.254: v56.44,23.28 56.94,23.53 58.19,23.53 59.19,24.03 61.44,24.03 63.44,22.03 63.44,18.53 S31.1
  Bottom 0.254: U2.58 53.94,23.53 54.19,23.28 v56.44,23.28
ROW2RR  (via drill 0.3, 0.8)
  Top 0.254: S35.2 v121.44,18.03
  Bottom 0.254: v121.44,18.03 v123.44,18.03
ROW3L  (via drill 0.3)
  Top 0.254: v30.94,10.03 27.94,7.03 S18.1
  Top 0.406: S17.2 S18.1
  Bottom 0.254: v30.94,10.03 U2.94
ROW3R  (via drill 0.3)
  Top 0.254: v63.44,6.28 S36.1
  Bottom 0.254: v63.44,6.28 62.69,6.28 62.44,6.03 55.94,6.03 55.44,6.53 54.94,21.53 53.44,23.03 U2.59
ROW3RR  (via drill 0.3)
  Top 0.254: S40.2 v120.94,10.71
  Bottom 0.254: v120.94,10.71 120.94,13.85 121.72,14.63 J2.1
TCK
  Bottom 0.254: 9.33,24.8 14.71,24.8 17.44,27.53 U2.131
  Bottom 0.406: J1.4 R1.2 5.52,23.53 6.79,24.8 9.33,24.8
TDI
  Bottom 0.254: U2.136 18.94,30.03 15.44,26.53 9.94,26.53 9.33,27.34
  Bottom 0.406: R3.1 4.89,26.07 | J1.3 R3.1 | R3.1 4.66,26.47 5.52,27.34 9.33,27.34
TDO
  Bottom 0.254: 9.33,28.61 9.37,28.61 10.94,27.03 14.94,27.03 18.44,30.53 U2.137
  Bottom 0.406: J1.2 9.33,28.61
TMS
  Bottom 0.254: 9.33,21.62 13.03,21.62 18.44,27.03 U2.130
  Bottom 0.406: J1.5 5.52,20.98 R2.1 6.38,21.21 6.79,21.62 9.33,21.62
VCCINT  (via drill 0.3)
  Top 0.305: v42.44,36.03 v22.44,36.03
  Top 0.61: v23.57,11.9 31.32,11.9 31.69,11.53 33.44,11.53 33.94,11.9 43.19,11.9 43.69,11.53 v44.44,11.53 45.31,11.53 45.69,11.9 55.56,11.9 55.94,11.53 56.94,11.53 57.31,11.9 v58.94,11.9
  Bottom 0.254: v42.44,36.03 U2.36 | 43.94,15.53 U2.72 | 23.69,12.03 23.94,12.53 U2.108 | C16.2 21.94,36.53 v22.44,36.03
  Bottom 0.305: U2.144 21.94,35.53 v22.44,36.03
  Bottom 0.61: 58.94,43.03 53.94,43.03 53.44,42.53 53.44,37.03 51.44,35.03 45.94,35.03 44.44,36.53 42.94,36.53 v42.44,36.03 | 58.94,43.03 79.44,43.03 81.38,44.97 U3.2 81.38,45.09 81.44,45.03 82.94,45.03 83.55,45.65 C10.2 | 43.94,15.53 43.94,13.53 44.44,13.03 v44.44,11.53 44.06,11.9 C17.2 | v58.94,11.9 58.94,43.03 | C18.2 23.69,10.78 23.69,12.03 v23.57,11.9